# EAGLE schematic wk2 (EAGLE 9.3.1)
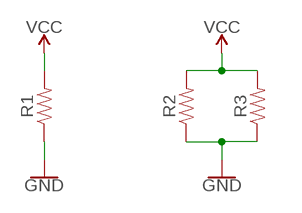
[diagram p0: schematic, sheet 1]

## Parts
R1  RESISTORAXIAL-0.3  [AXIAL-0.3]
R2  RESISTORAXIAL-0.3  [AXIAL-0.3]
R3  RESISTORAXIAL-0.3  [AXIAL-0.3]

## Nets
GND: R1.P$1 R2.P$1 R3.P$1
VCC: R1.P$2 R2.P$2 R3.P$2

## Library data of the parts
R1-R3 = SparkFun-Resistors:RESISTOR: Generic Resistor Package